# EAGLE design RaspiRobot_Board (EAGLE 6.4)
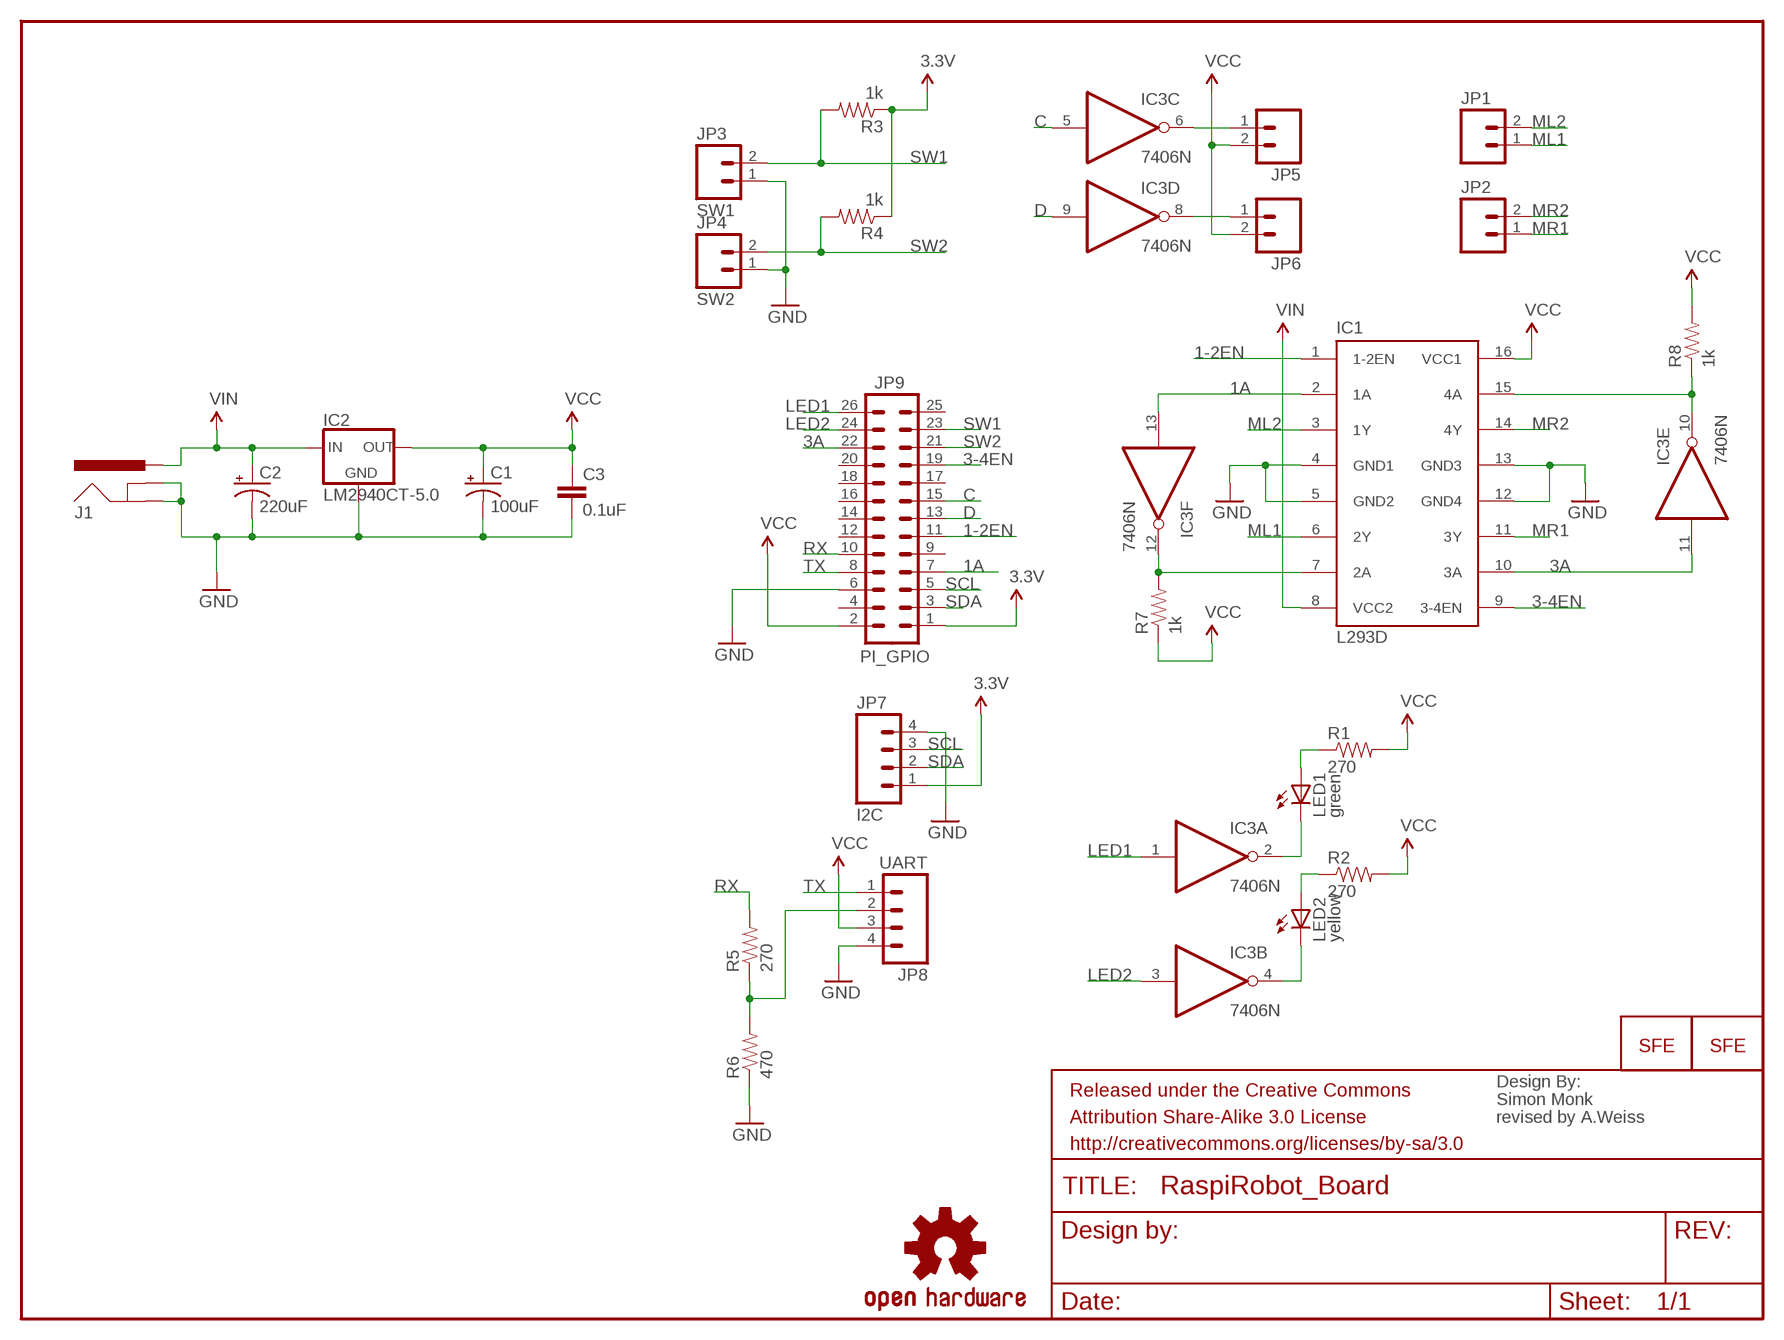
[diagram p0: schematic, sheet 1]

## Parts
C1  100uF  CAP_POLPTH1  [CPOL-RADIAL-100UF-25V]
C2  220uF  CAP_POLPTH1  [CPOL-RADIAL-100UF-25V]
C3  0.1uF  CAPKIT  [CAP-PTH-SMALL-KIT]
FRAME1  FRAME-LETTER  [CREATIVE_COMMONS]
IC1  L293D  [DIL16]
IC2  LM2940CT-5.0  V_REG_78XXSINK  [TO220-IGO]
IC3  7406N  [DIL14]
J1  POWER_JACKPTH_LOCK  [POWER_JACK_PTH_LOCK]
JP1  M023.5MM_LOCK  [SCREWTERMINAL-3.5MM-2_LOCK]
JP2  M023.5MM_LOCK  [SCREWTERMINAL-3.5MM-2_LOCK]
JP3  SW1  M02PTH  [1X02]
JP4  SW2  M02PTH  [1X02]
JP5  M02PTH  [1X02]
JP6  M02PTH  [1X02]
JP7  I2C  M04PTH  [1X04]
JP8  UART  M04PTH  [1X04]
JP9  M13X22X13  [2X13]
JP10  LOGO-SFENEW  [SFE-NEW-WEBLOGO]
JP11  LOGO-SFENEW  [SFE-NEW-WEBLOGO]
LED1  green  LED3MM  [LED3MM]
LED2  yellow  LED3MM  [LED3MM]
R1  270  RESISTOREZ  [AXIAL-0.3EZ]
R2  270  RESISTOREZ  [AXIAL-0.3EZ]
R3  1k  RESISTOREZ  [AXIAL-0.3EZ]
R4  1k  RESISTOREZ  [AXIAL-0.3EZ]
R5  270  RESISTOREZ  [AXIAL-0.3EZ]
R6  470  RESISTOREZ  [AXIAL-0.3EZ]
R7  1k  RESISTOREZ  [AXIAL-0.3EZ]
R8  1k  RESISTOREZ  [AXIAL-0.3EZ]
U$4  OSHW-LOGOS  [OSHW-LOGO-S]

## Nets
1-2EN: IC1.1(1-2EN) JP9.11
1A: IC1.2(1A) IC3.13(F:I) JP9.7
3-4EN: IC1.9(3-4EN) JP9.19
3.3V: JP7.1 JP9.1 R3.P$1 R4.P$1
3A: IC1.10(3A) IC3.11(E:I) JP9.22
C: IC3.5(C:I) JP9.15
D: IC3.9(D:I) JP9.13
GND: C1.2(-) C2.2(-) C3.2 IC1.4(GND1) IC1.5(GND2) IC1.12(GND4) IC1.13(GND3) IC2.GND J1.GND J1.GNDBREAK JP3.1 JP4.1 JP7.4 JP8.4 JP9.6 R6.P$1
LED1: IC3.1(A:I) JP9.26
LED2: IC3.3(B:I) JP9.24
ML1: IC1.6(2Y) JP1.1
ML2: IC1.3(1Y) JP1.2
MR1: IC1.11(3Y) JP2.1
MR2: IC1.14(4Y) JP2.2
N$6: IC1.7(2A) IC3.12(F:O) R7.P$2
N$7: IC1.15(4A) IC3.10(E:O) R8.P$1
N$9: LED1.A R1.P$1
N$10: LED2.A R2.P$1
N$11: IC3.2(A:O) LED1.K(C)
N$12: IC3.4(B:O) LED2.K(C)
N$13: IC3.6(C:O) JP5.1
N$14: IC3.8(D:O) JP6.1
N$18: JP8.2 R5.P$1 R6.P$2
RX: JP9.10 R5.P$2
SCL: JP7.3 JP9.5
SDA: JP7.2 JP9.3
SW1: JP3.2 JP9.23 R3.P$2
SW2: JP4.2 JP9.21 R4.P$2
TX: JP8.1 JP9.8
VCC: C1.1(+) C3.1 IC1.16(VCC1) IC2.OUT JP5.2 JP6.2 JP8.3 JP9.2 R1.P$2 R2.P$2 R7.P$1 R8.P$2
VIN: C2.1(+) IC1.8(VCC2) IC2.IN J1.PWR
Unconnected: JP9.4 JP9.9 JP9.12 JP9.14 JP9.16 JP9.17 JP9.18 JP9.20 JP9.25

## Notes on the sheet
- PI_GPIO
- Design By:
- Simon Monk
- revised by A.Weiss

## Power pins joined to a net without a drawn wire
GND: IC3.7(P:GND)
VCC: IC3.14(P:VCC)

## Library data of the parts
C1 = SparkFun:CAP_POL: Capacitor Polarized These are standard SMD and PTH capacitors. Normally 10uF, 47uF, and 100uF in electrolytic and tantalum varieties. Always verify the external diameter of the through hole cap, it varies with capacity, voltage, and manufacturer. The EIA devices should be standard.
C2 = SparkFun-Capacitors:CAP_POL: Capacitor Polarized These are standard SMD and PTH capacitors. Normally 10uF, 47uF, and 100uF in electrolytic and tantalum varieties. Always verify the external diameter of the through hole cap, it varies with capacity, voltage, and manufacturer. The EIA devices should be standard.
C3 = SparkFun-Capacitors:CAP: Capacitor Standard 0603 ceramic capacitor, and 0.1" leaded capacitor.
FRAME1 = SparkFun-Aesthetics:FRAME-LETTER: Schematic Frame Standard 8.5x11 US Letter frame
IC1 = st-microelectronics:L293D: PUSH-PULL 4 CHANNEL DRIVER; MPN: L293D; OC_FARNELL: 9589619; OC_NEWARK: 56P8249
IC2 = SparkFun:V_REG_78XX: Voltage Regulator Standard 7805 5V regulator. IGO (Input Ground Output). Spark Fun Electronics SKU : COM-00107
IC3 = 74xx-eu:74*06: Hex INVERTER, open collector high-voltage output
J1 = SparkFun-Connectors:POWER_JACK: Power Jack This is the standard 5.5mm barrel jack for power. The PTH is the most common, proven, reliable, footprint. All others are experimental. The Slot footprint only works if the mill layer is transmitted to the PCB fab house so be warned. Spark Fun Electronics SKU : PRT-00119. Mating wall wart : TOL-00298 (and others)
JP1-JP6 = SparkFun-Connectors:M02: Header 2 Standard 2-pin 0.1" header. Use with straight break away headers (SKU : PRT-00116), right angle break away headers (PRT-00553), swiss pins (PRT-00743), machine pins (PRT-00117), and female headers (PRT-00115). Molex polarized connector foot print use with SKU : PRT-08233 with associated crimp pins and housings.
JP7 JP8 = SparkFun-Connectors:M04: Header 4 Standard 4-pin 0.1" header. Use with straight break away headers (SKU : PRT-00116), right angle break away headers (PRT-00553), swiss pins (PRT-00743), machine pins (PRT-00117), and female headers (PRT-00115). Molex polarized connector foot print use with SKU : PRT-08231 with associated crimp pins and housings. 1MM SMD Version SKU: PRT-10208
JP9 = SparkFun-Connectors:M13X2
JP10 JP11 = SparkFun-Aesthetics:LOGO-SFE: Spark Fun Electronics PCB Logo This is the standard Spark Fun Electronics PCB logo.
LED1 LED2 = SparkFun-LED:LED: LEDs Standard schematic elements and footprints for 5mm, 3mm, 1206, and 0603 sized LEDs. 5mm - Spark Fun Electronics SKU : COM-00529 (and others)
R1-R8 = SparkFun-Passives:RESISTOR: Resistor Basic schematic elements and footprints for 0603, 1206, and PTH resistors.
U$4 = SparkFun-Aesthetics:OSHW-LOGO: Open Source Hardware Logo This logo indicates the piece of hardware it is found on incorporates a OSHW license and/or adheres to the definition of open source hardware found here: http://freedomdefined.org/OSHW

## Board
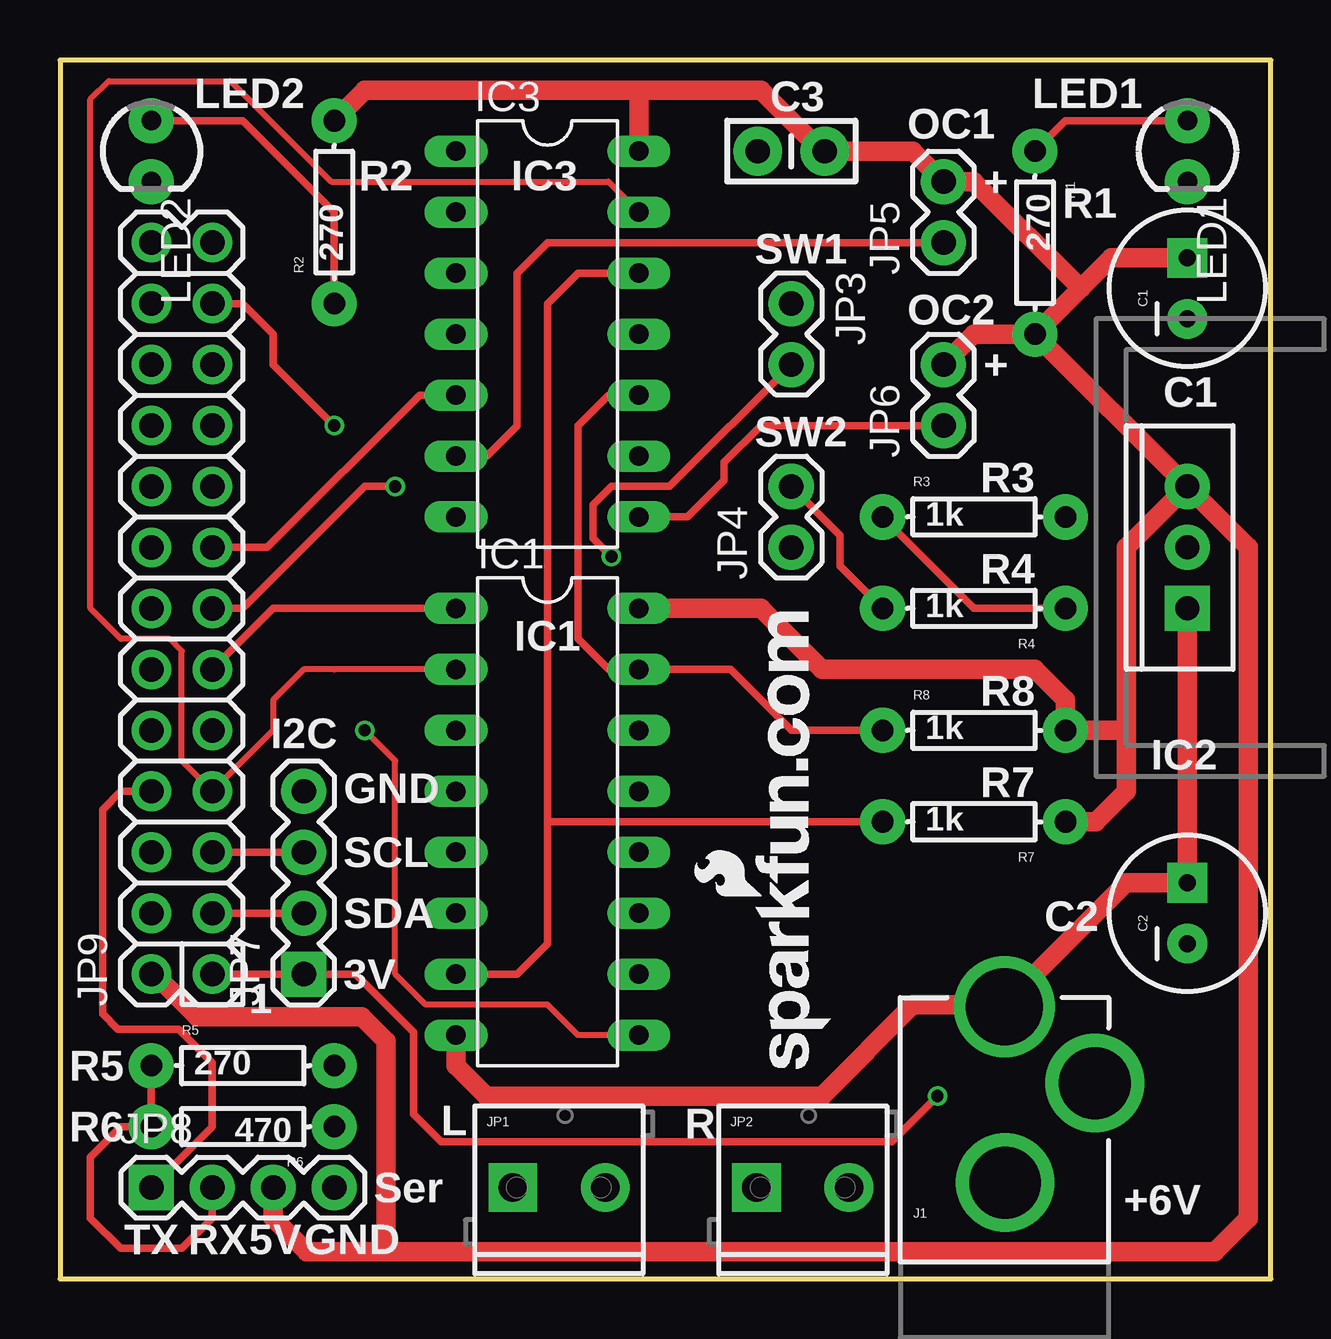
[diagram p1: board, top side]
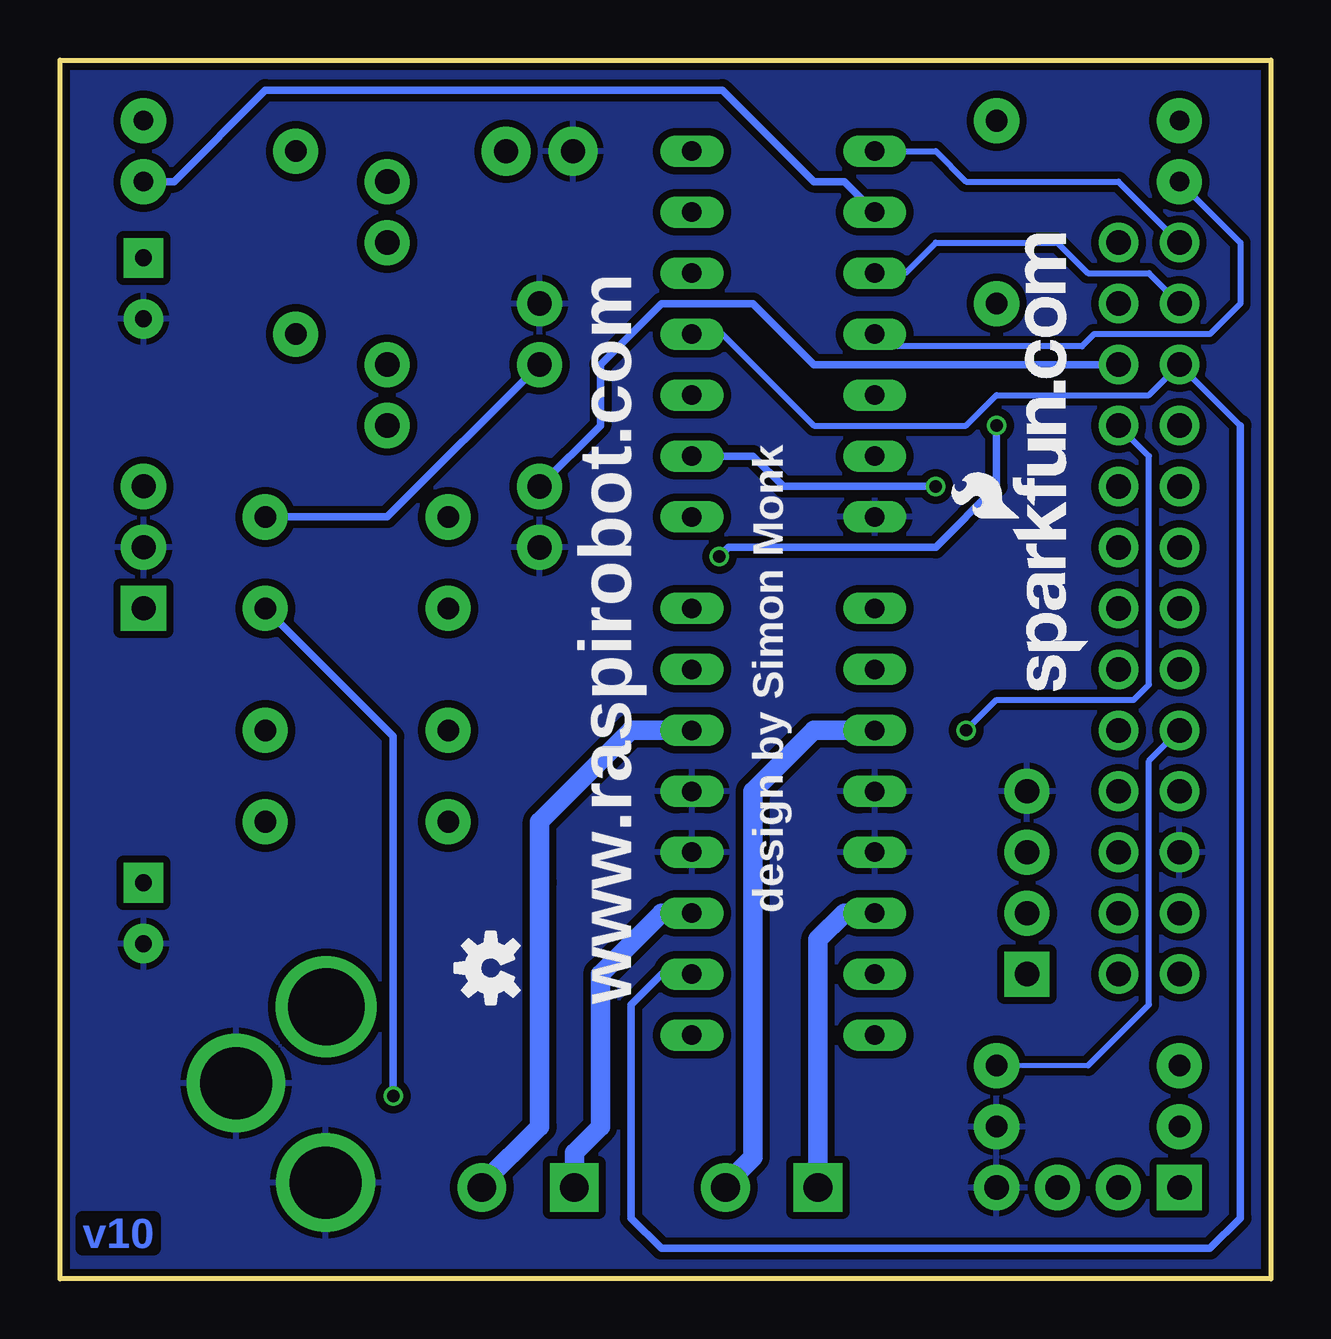
[diagram p2: board, bottom side, seen from below]

Size 50.47 x 50.79 mm. Coordinates in mm from the lower left corner, seen from the top.
Outline: 0,0 50.47,0 50.47,50.79 0,50.79 0,0
Copper layers (1*16): Top 0.035mm / dielectric 1.5mm / Bottom 0.035mm
Design rules "default": minimum track width 8mil, minimum drill 12mil, track to track 12mil, track to pad 12mil, pad to pad 12mil, via to via 12mil, smd to smd 0mil, copper to edge 10mil, drill to drill 10mil, minimum pad ring 10mil, minimum via ring 6mil, stop-mask expansion 2mil, vias tented up to drill 100mil, thermal gap 10mil

### Footprints (pad centres in the part's own frame; a part is rotated, then mirrored left to right if it is on the bottom)
CPOL-RADIAL-100UF-25V = drill 0.7 pad 1.651 square: 1 1.27,0 | drill 0.7 pad 1.651: 2 -1.27,0
CAP-PTH-SMALL-KIT = drill 1.016 pad 2.032: 1 -1.397,0; 2 1.397,0
DIL16 = drill 0.813 long: 1 -8.89,-3.81; 2 -6.35,-3.81; 3 -3.81,-3.81; 4 -1.27,-3.81; 5 1.27,-3.81; 6 3.81,-3.81; 7 6.35,-3.81; 8 8.89,-3.81; 9 8.89,3.81; 10 6.35,3.81; 11 3.81,3.81; 12 1.27,3.81; 13 -1.27,3.81; 14 -3.81,3.81; 15 -6.35,3.81; 16 -8.89,3.81
TO220-IGO = drill 1 pad 1.88: GND 0,0; OUT 2.54,0 | drill 1 pad 1.88 square: IN -2.54,0
DIL14 = drill 0.813 long: 1 -7.62,-3.81; 2 -5.08,-3.81; 3 -2.54,-3.81; 4 0,-3.81; 5 2.54,-3.81; 6 5.08,-3.81; 7 7.62,-3.81; 8 7.62,3.81; 9 5.08,3.81; 10 2.54,3.81; 11 0,3.81; 12 -2.54,3.81; 13 -5.08,3.81; 14 -7.62,3.81
POWER_JACK_PTH_LOCK = drill 2.997 pad 4.115: GND 0.025,6.557; GNDBREAK 3.762,10.7 | drill 3.2 pad 4.115: PWR 0,13.878
SCREWTERMINAL-3.5MM-2_LOCK = drill 1.2 pad 2.032 square: 1 -0.178,0 | drill 1.2 pad 2.032: 2 3.678,0
1X02 = drill 1.016 pad 1.88: 1 0,0; 2 2.54,0
1X04 = drill 1.016 pad 1.88 square: 1 0,0 | drill 1.016 pad 1.88: 2 2.54,0; 3 5.08,0; 4 7.62,0
2X13 = drill 1.016 pad 1.651: 1 0,0; 2 0,2.54; 3 2.54,0; 4 2.54,2.54; 5 5.08,0; 6 5.08,2.54; 7 7.62,0; 8 7.62,2.54; 9 10.16,0; 10 10.16,2.54; 11 12.7,0; 12 12.7,2.54; 13 15.24,0; 14 15.24,2.54; 15 17.78,0; 16 17.78,2.54; 17 20.32,0; 18 20.32,2.54; 19 22.86,0; 20 22.86,2.54; 21 25.4,0; 22 25.4,2.54; 23 27.94,0; 24 27.94,2.54; 25 30.48,0; 26 30.48,2.54
LED3MM = drill 0.813 pad 1.88: A -1.27,0; K 1.27,0
AXIAL-0.3EZ = drill 0.9 pad 1.88: P$1 -3.81,0; P$2 3.81,0

### Placement (x,y rotation side)
C1  46.99,41.27 90 top
C2  46.99,15.24 90 top
C3  30.48,46.99 180 top
FRAME1  21.59,-11.43 0 top  (outside the outline)
IC1  20.32,19.05 270 top
IC2  46.99,30.48 90 top
IC3  20.32,39.37 270 top
J1  39.37,-2.54 0 top
JP1  19.05,3.81 0 top
JP2  29.21,3.81 0 top
JP3  30.48,40.64 270 top
JP4  30.48,30.48 90 top
JP5  36.83,43.18 90 top
JP6  36.83,35.56 90 top
JP7  10.16,12.7 90 top
JP8  3.81,3.81 0 top
JP9  6.35,12.7 90 top
JP10  32.13,8.76 90 top
JP11  7.62,24.51 90 bottom
LED1  46.99,46.99 270 top
LED2  3.81,46.99 270 top
R1  40.64,43.18 270 top
R2  11.43,44.45 90 top
R3  38.1,31.75 0 top
R4  38.1,27.94 180 top
R5  7.62,8.89 0 top
R6  7.62,6.35 180 top
R7  38.1,19.05 180 top
R8  38.1,22.86 0 top
U$4  32.51,12.95 90 bottom

### Tracks (layer width: path | path; a pad name or v marks a point on that pad's centre or on a via)
1-2EN
  Top 0.305: IC1.1 8.89,27.94 JP9.11
1A
  Top 0.254: IC1.2 11.43,25.4 10.16,25.4 8.89,24.13 8.89,22.86 JP9.7 5.08,21.59 5.08,24.13 5.08,26.16 4.57,26.67 2.54,26.67 1.27,27.94 1.27,49.15 2.03,49.91 7.11,49.91 11.3,45.72 22.86,45.72 IC3.13
3-4EN  (via drill 0.51)
  Top 0.254: IC1.9 21.59,10.16 20.32,11.43 15.24,11.43 13.97,12.7 13.97,21.59 v12.7,22.86
  Bottom 0.254: v12.7,22.86 11.43,24.13 5.71,24.13 5.08,24.77 5.08,34.29 JP9.19
3.3V  (via drill 0.51)
  Top 0.305: R4.P$1 38.1,27.94 R3.P$1 | v36.58,7.62 34.67,5.71 33.66,5.71 15.88,5.71 14.73,6.86 14.73,10.29 12.32,12.7 JP7.1 JP9.1
  Bottom 0.305: R4.P$1 36.83,22.86 36.58,22.61 v36.58,7.62
3A
  Bottom 0.254: IC3.11 22.86,39.37 21.59,38.1 19.05,35.56 12.7,35.56 11.43,36.83 5.08,36.83 JP9.22 1.27,35.56
  Bottom 0.305: IC1.10 25.4,12.7 26.67,11.43 26.67,2.54 25.4,1.27 2.54,1.27 1.27,2.54 1.27,35.56
C
  Top 0.305: IC3.5 14.99,36.83 8.64,30.48 JP9.15
D  (via drill 0.51)
  Top 0.305: v13.97,33.02 12.7,33.02 8.89,29.21 7.62,27.94 JP9.13
  Bottom 0.305: v13.97,33.02 20.32,33.02 21.59,34.29 IC3.9
GND
  pour Bottom (isolate 0.305): 0,50.8 50.8,50.8 50.8,0 0,0
LED1
  Bottom 0.254: IC3.1 13.97,46.99 12.7,45.72 6.35,45.72 JP9.26
LED2
  Bottom 0.254: IC3.3 15.24,41.91 13.97,43.18 8.89,43.18 7.62,41.91 5.08,41.91 JP9.24
ML1
  Bottom 0.813: JP1.1 18.87,14.15 17.78,15.24 IC1.6
ML2
  Bottom 0.813: JP1.2 22.73,3.94 21.59,5.08 21.59,17.78 21.59,20.32 19.05,22.86 IC1.3
MR1
  Bottom 0.813: JP2.1 29.03,5.26 27.94,6.35 27.94,12.7 25.4,15.24 IC1.11
MR2
  Bottom 0.813: JP2.2 32.89,3.94 30.48,6.35 30.48,16.51 30.48,19.05 26.67,22.86 IC1.14
N$6
  Top 0.305: R7.P$2 20.32,19.05 | 20.32,19.05 20.32,13.97 19.05,12.7 IC1.7 | 20.32,19.05 20.32,40.64 21.59,41.91 IC3.12
N$7
  Top 0.305: R8.P$1 30.48,22.86 27.94,25.4 IC1.15 22.86,25.4 21.59,26.67 21.59,35.56 22.86,36.83 IC3.10
N$9
  Top 0.305: LED1.A 41.91,48.26 R1.P$1
N$10
  Top 0.305: LED2.A 7.62,48.26 11.43,44.45 R2.P$1
N$11
  Bottom 0.305: LED1.K 45.72,45.72 41.91,49.53 22.86,49.53 19.05,45.72 17.78,45.72 IC3.2
N$12
  Bottom 0.254: LED2.K 1.27,43.18 1.27,40.64 2.54,39.37 7.37,39.37 7.87,38.86 16,38.86 IC3.4
N$13
  Top 0.305: IC3.6 17.78,34.29 19.05,35.56 19.05,36.83 19.05,41.91 20.32,43.18 33.02,43.18 JP5.1
N$14
  Top 0.305: IC3.8 26.16,31.75 27.69,33.27 27.69,34.04 29.21,35.56 JP6.1
N$18
  Top 0.305: JP8.2 6.35,2.54 5.08,1.27 2.54,1.27 1.27,2.54 1.27,5.08 2.54,6.35 R6.P$2 R5.P$1
RX
  Bottom 0.203: 7.62,8.89 R5.P$2
  Bottom 0.254: 7.62,8.89 5.08,11.43 5.08,21.59 JP9.10
SCL
  Top 0.305: JP9.5 JP7.3
SDA
  Top 0.305: JP7.2 JP9.3
SW1  (via drill 0.51)
  Top 0.305: v11.43,35.56 8.89,38.1 8.89,39.37 7.62,40.64 JP9.23 | JP3.2 25.4,33.02 22.99,33.02 22.23,32.26 22.23,30.86 v22.99,30.1
  Bottom 0.305: R3.P$2 36.83,31.75 JP3.2 | v11.43,35.56 11.43,33.02 13.97,30.48 22.61,30.48 v22.99,30.1
SW2
  Top 0.305: R4.P$2 33.02,29.21 32.51,29.72 32.51,30.99 JP4.2
  Bottom 0.305: JP4.2 27.94,35.56 27.94,38.1 26.67,39.37 25.4,40.64 21.59,40.64 19.05,38.1 JP9.21
TX
  Top 0.305: JP8.1 6.35,6.35 6.35,9.02 5.08,10.29 4.95,10.41 2.41,10.41 1.78,11.05 1.78,19.56 2.54,20.32 JP9.8
VCC
  Top 0.813: JP8.3 8.89,2.54 10.29,1.14 13.72,1.14 | C1.1 43.81,42.55 42.55,41.27 | 42.55,41.27 R1.P$2 | 42.55,41.27 38.1,45.72 JP5.2 35.56,46.99 C3.1 31.75,46.99 29.21,49.53 24.13,49.53 | 24.13,49.53 12.7,49.53 R2.P$2 | IC3.14 24.13,49.53 | 13.72,1.14 48.13,1.14 49.53,2.54 49.53,30.48 IC2.OUT | R1.P$2 38.1,39.37 JP6.2 | IC2.OUT R1.P$2 | R7.P$1 43.18,19.05 44.45,20.32 44.45,22.86 | 44.45,22.86 44.45,30.48 IC2.OUT | IC1.16 29.21,27.94 31.75,25.4 40.64,25.4 41.91,24.13 R8.P$2 44.45,22.86 | JP9.2 4.19,12.32 4.32,12.32 5.71,10.92 12.57,10.92 13.59,9.91 13.59,1.27 13.72,1.14
VIN
  Top 0.813: IC2.IN C2.1 44.45,16.51 39.37,11.43 | 39.37,11.43 35.56,11.43 31.75,7.62 17.78,7.62 16.51,8.89 IC1.8 | J1.PWR 39.37,11.43

### Text on the board
Bottom: v10
tPlace: LED2 | C3 | LED1 | OC1 | R2 | IC3 | + | R1 | SW1 | OC2 | + | C1 | SW2 | R3 | R4 | IC1 | R8 | I2C | IC2 | GND | R7 | SCL | SDA | C2 | 3V | 1 | R5 | R6 | L | R | Ser | +6V | TX | RX | 5V | GND
bPlace: www.raspirobot.com | design by Simon Monk